# Altium schematic sheet csi.SchDoc
size A3; DocumentNumber: 1; SheetNumber: 1; SheetTotal: 6; PageSetup: Record=PageOptions|CenterHorizontal=True|CenterVertical=True|PrintScale=0.97|XCorrection=1.00|YCorrection=1.00|PrintKind=1|BorderSize=5000000|LeftOffset=0|BottomOffset=0|Orientation=2|PaperLength=2970|PaperWidth=2100|Scale=100|PaperSource=7|PrintQuality=600|MediaType=1|DitherType=10|PaperKind=A4|PrintScaleMode=1
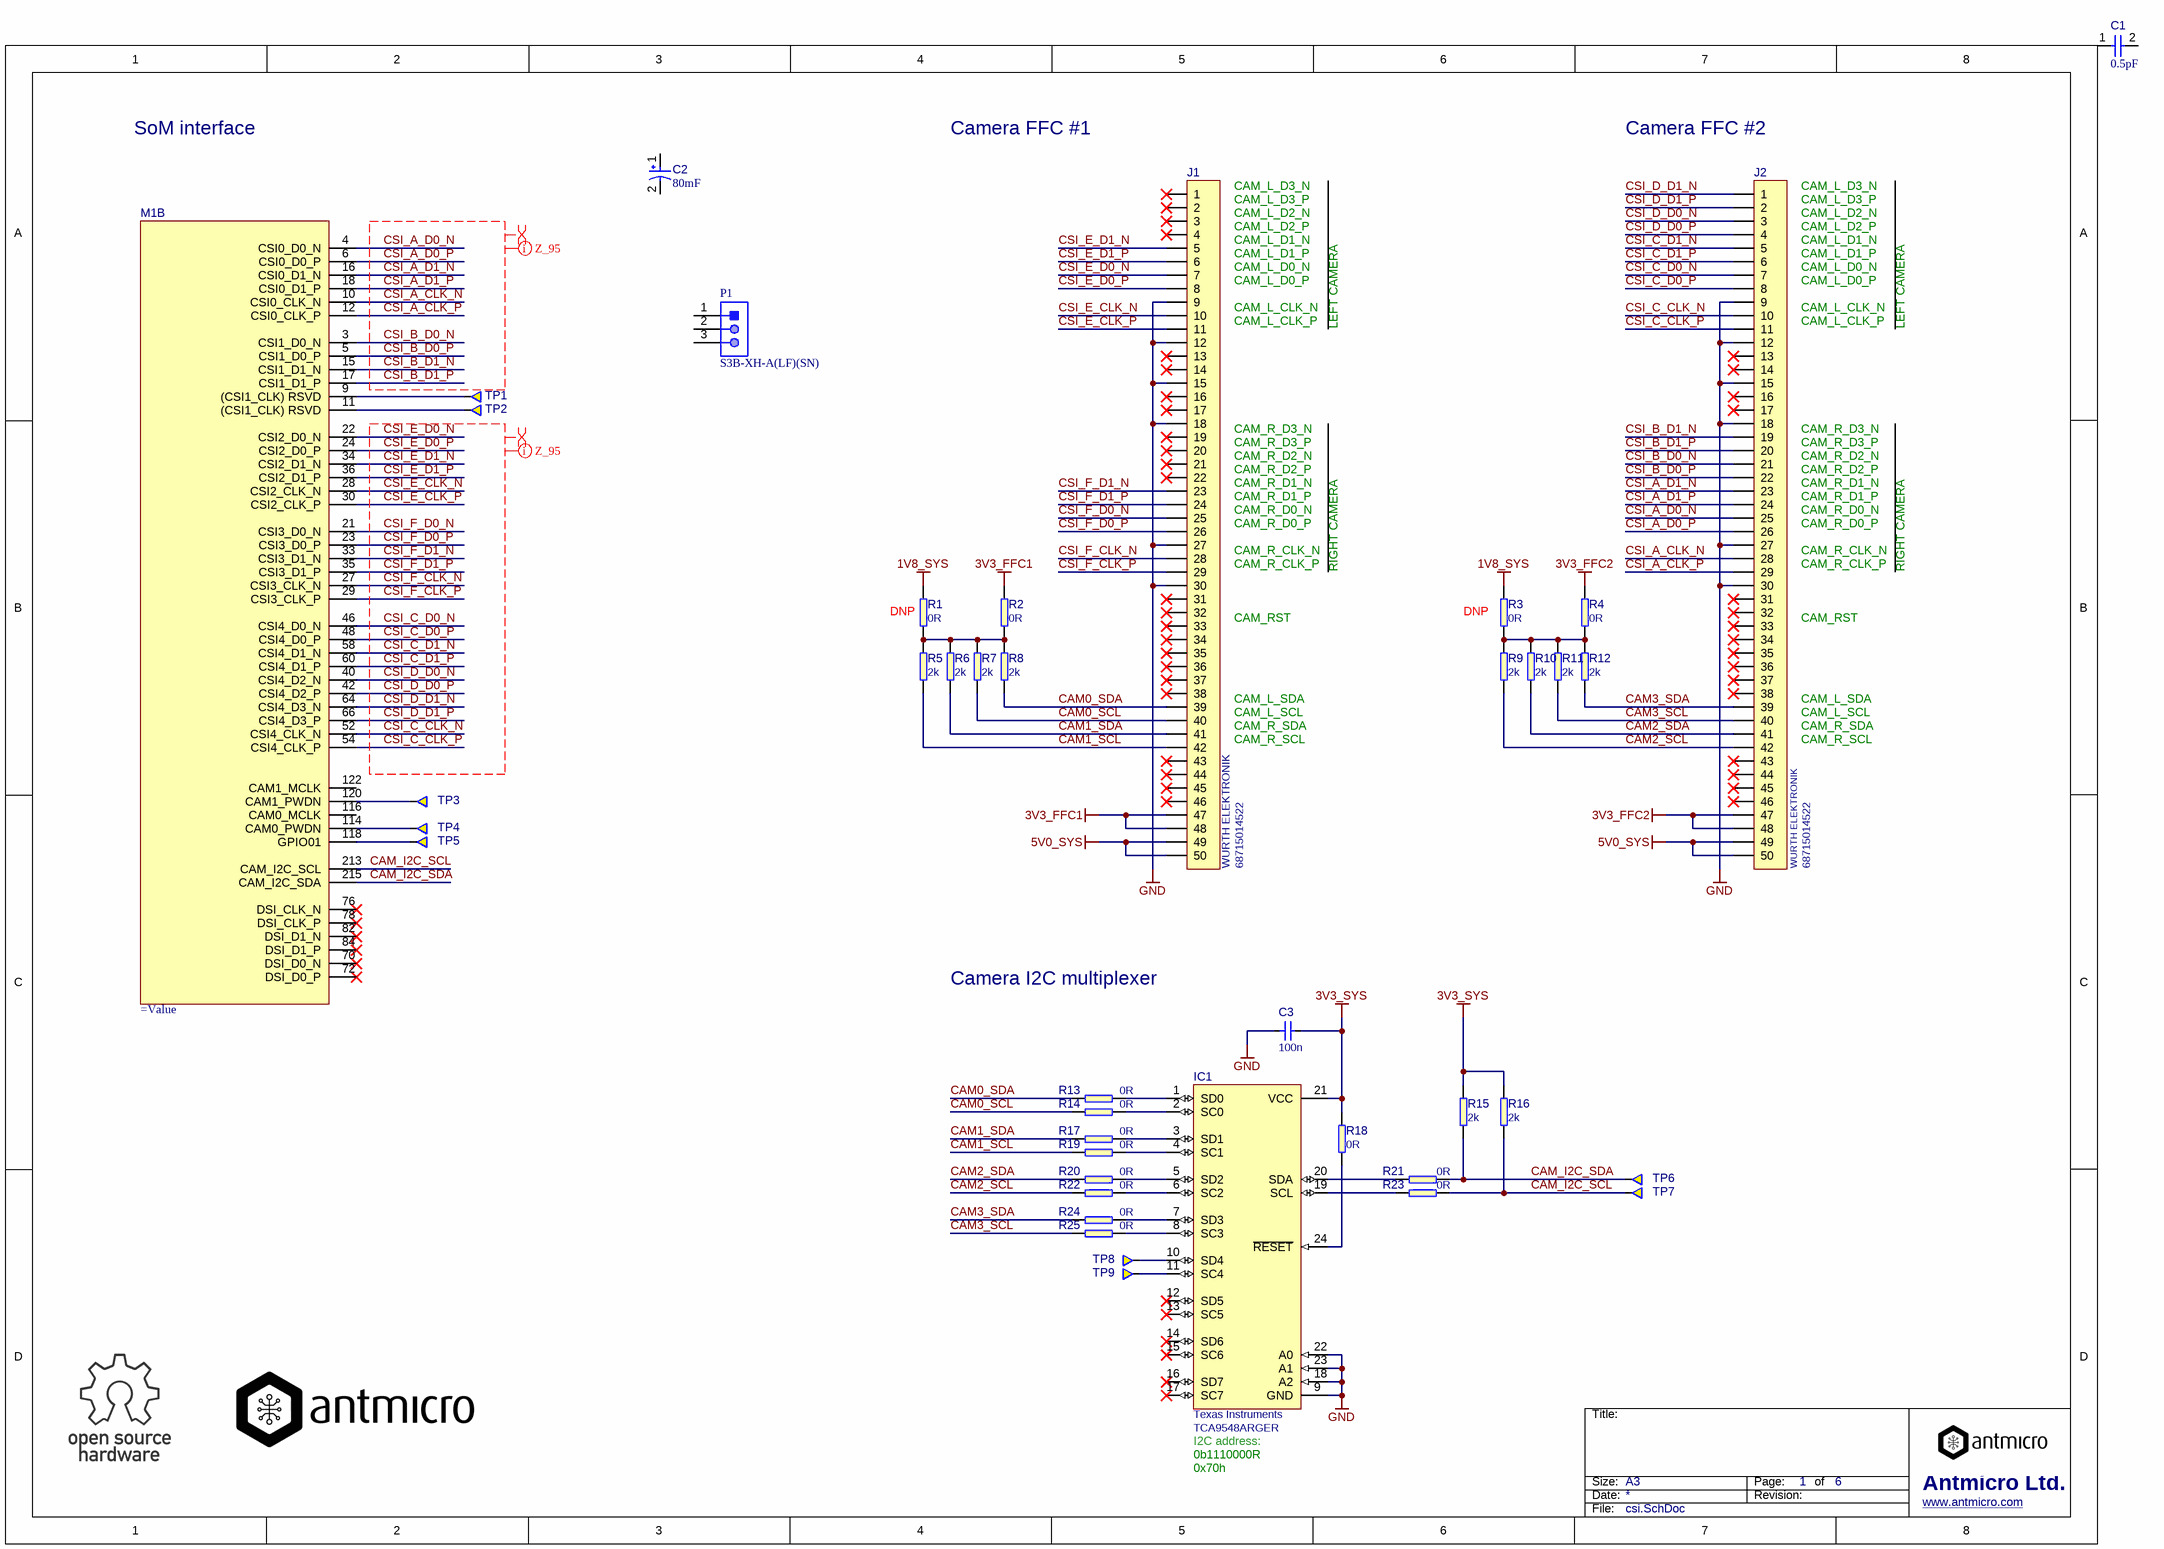
[diagram p0: csi.SchDoc]

## Parts
C1  value 0.5pF  [CAPC1005X56X25ML10T15]  (hidden comment: Capacitor 0.5 pF +/- 0.1pF 25 V 0402)
C2  value 80mF  [SEIK-XH414HG-IV01E_V]  (hidden comment: XH414HG-IV01E)
C3  100n  [0402]
IC1  TCA9548ARGER  Manufacturer: Texas Instruments  [VQFN-24]
J1  68715014522  Manufacturer: WURTH ELEKTRONIK  [68715014522]
J2  68715014522  Manufacturer: WURTH ELEKTRONIK  [68715014522]
M1  (no value)  [jetson-nano-connector]  (part B of 7)
P1  S3B-XH-A(LF)(SN)  [JST-S3B-XH-A(LF)(SN)_V]
R1  0R  [0402]
R2  0R  [0402]
R3  0R  [0402]
R4  0R  [0402]
R5  2k  [0402]
R6  2k  [0402]
R7  2k  [0402]
R8  2k  [0402]
R9  2k  [0402]
R10  2k  [0402]
R11  2k  [0402]
R12  2k  [0402]
R13  0R  [0402]
R14  0R  [0402]
R15  2k  [0402]
R16  2k  [0402]
R17  0R  [0402]
R18  0R  [0402]
R19  0R  [0402]
R20  0R  [0402]
R21  0R  [0402]
R22  0R  [0402]
R23  0R  [0402]
R24  0R  [0402]
R25  0R  [0402]
TP1  Testpad  [TP-R-1.5]  (value not drawn)  (no BOM)
TP2  Testpad  [TP-R-1.5]  (value not drawn)  (no BOM)
TP3  Testpad  [TP-R-1.5]  (value not drawn)  (no BOM)
TP4  Testpad  [TP-R-1.5]  (value not drawn)  (no BOM)
TP5  Testpad  [TP-R-1.5]  (value not drawn)  (no BOM)
TP6  Testpad  [TP-R-1.5]  (value not drawn)  (no BOM)
TP7  Testpad  [TP-R-1.5]  (value not drawn)  (no BOM)
TP8  Testpad  [TP-R-1.5]  (value not drawn)  (no BOM)
TP9  Testpad  [TP-R-1.5]  (value not drawn)  (no BOM)

## Nets
1V8_SYS: R1.2 R3.2
3V3_FFC1: J1.47 J1.48 R2.2
3V3_FFC2: J2.47 J2.48 R4.2
3V3_SYS: C3.2 IC1.21(VCC) R15.1 R16.1 R18.2
5V0_SYS: J1.49 J1.50 J2.49 J2.50
GND: C3.1 IC1.9(GND) IC1.18(A2) IC1.22(A0) IC1.23(A1) J1.9 J1.12 J1.15 J1.18 J1.27 J1.30 J2.9 J2.12 J2.15 J2.18 J2.27 J2.30
CAM0_SCL: J1.40 R7.2 R14.1
CAM0_SDA: J1.39 R8.2 R13.1
CAM1_SCL: J1.42 R5.2 R19.1
CAM1_SDA: J1.41 R6.2 R17.1
CAM2_SCL: J2.42 R9.2 R22.1
CAM2_SDA: J2.41 R10.2 R20.1
CAM3_SCL: J2.40 R11.2 R25.1
CAM3_SDA: J2.39 R12.2 R24.1
CAM_I2C_SCL: M1.213(CAM_I2C_SCL) R16.2 R23.2 TP7.1
CAM_I2C_SDA: M1.215(CAM_I2C_SDA) R15.2 R21.2 TP6.1
CSI_A_CLK_N: J2.28 M1.10(CSI0_CLK_N)
CSI_A_CLK_P: J2.29 M1.12(CSI0_CLK_P)
CSI_A_D0_N: J2.25 M1.4(CSI0_D0_N)
CSI_A_D0_P: J2.26 M1.6(CSI0_D0_P)
CSI_A_D1_N: J2.23 M1.16(CSI0_D1_N)
CSI_A_D1_P: J2.24 M1.18(CSI0_D1_P)
CSI_B_D0_N: J2.21 M1.3(CSI1_D0_N)
CSI_B_D0_P: J2.22 M1.5(CSI1_D0_P)
CSI_B_D1_N: J2.19 M1.15(CSI1_D1_N)
CSI_B_D1_P: J2.20 M1.17(CSI1_D1_P)
CSI_C_CLK_N: J2.10 M1.52(CSI4_CLK_N)
CSI_C_CLK_P: J2.11 M1.54(CSI4_CLK_P)
CSI_C_D0_N: J2.7 M1.46(CSI4_D0_N)
CSI_C_D0_P: J2.8 M1.48(CSI4_D0_P)
CSI_C_D1_N: J2.5 M1.58(CSI4_D1_N)
CSI_C_D1_P: J2.6 M1.60(CSI4_D1_P)
CSI_D_D0_N: J2.3 M1.40(CSI4_D2_N)
CSI_D_D0_P: J2.4 M1.42(CSI4_D2_P)
CSI_D_D1_N: J2.1 M1.64(CSI4_D3_N)
CSI_D_D1_P: J2.2 M1.66(CSI4_D3_P)
CSI_E_CLK_N: J1.10 M1.28(CSI2_CLK_N)
CSI_E_CLK_P: J1.11 M1.30(CSI2_CLK_P)
CSI_E_D0_N: J1.7 M1.22(CSI2_D0_N)
CSI_E_D0_P: J1.8 M1.24(CSI2_D0_P)
CSI_E_D1_N: J1.5 M1.34(CSI2_D1_N)
CSI_E_D1_P: J1.6 M1.36(CSI2_D1_P)
CSI_F_CLK_N: J1.28 M1.27(CSI3_CLK_N)
CSI_F_CLK_P: J1.29 M1.29(CSI3_CLK_P)
CSI_F_D0_N: J1.25 M1.21(CSI3_D0_N)
CSI_F_D0_P: J1.26 M1.23(CSI3_D0_P)
CSI_F_D1_N: J1.23 M1.33(CSI3_D1_N)
CSI_F_D1_P: J1.24 M1.35(CSI3_D1_P)
NetIC1_1: IC1.1(SD0) R13.2
NetIC1_2: IC1.2(SC0) R14.2
NetIC1_3: IC1.3(SD1) R17.2
NetIC1_4: IC1.4(SC1) R19.2
NetIC1_5: IC1.5(SD2) R20.2
NetIC1_6: IC1.6(SC2) R22.2
NetIC1_7: IC1.7(SD3) R24.2
NetIC1_8: IC1.8(SC3) R25.2
NetIC1_10: IC1.10(SD4) TP8.1
NetIC1_11: IC1.11(SC4) TP9.1
NetIC1_19: IC1.19(SCL) R23.1
NetIC1_20: IC1.20(SDA) R21.1
NetIC1_24: IC1.24(~{RESET}) R18.1
NetM1_9: M1.9((CSI1_CLK)_RSVD) TP1.1
NetM1_11: M1.11((CSI1_CLK)_RSVD) TP2.1
NetM1_114: M1.114(CAM0_PWDN) TP4.1
NetM1_118: M1.118(GPIO01) TP5.1
NetM1_120: M1.120(CAM1_PWDN) TP3.1
NetR1_1: R1.1 R2.1 R5.1 R6.1 R7.1 R8.1
NetR3_1: R3.1 R4.1 R9.1 R10.1 R11.1 R12.1

Not connected (* = marked no-connect by the designer): C1 1 2; C2 1 2; IC1 12(SD5)* 13(SC5)* 14(SD6)* 15(SC6)* 16(SD7)* 17(SC7)*; J1 1* 2* 3* 4* 13* 14* 16* 17* 19* 20* 21* 22* 31* 32* 33* 34* 35* 36* 37* 38* 43* 44* 45* 46*; J2 13* 14* 16* 17* 31* 32* 33* 34* 35* 36* 37* 38* 43* 44* 45* 46*; M1 70(DSI_D0_N)* 72(DSI_D0_P)* 76(DSI_CLK_N)* 78(DSI_CLK_P)* 82(DSI_D1_N)* 84(DSI_D1_P)* 116(CAM0_MCLK) 122(CAM1_MCLK); P1 1 2 3

## Layout directives
differential pair: CSI_A_CLK_N, CSI_A_CLK_P, CSI_A_D0_N, CSI_A_D0_P, CSI_A_D1_N, CSI_A_D1_P, CSI_B_D0_N, CSI_B_D0_P, CSI_B_D1_N, CSI_B_D1_P, CSI_C_CLK_N, CSI_C_CLK_P, CSI_C_D0_N, CSI_C_D0_P, CSI_C_D1_N, CSI_C_D1_P, CSI_D_D0_N, CSI_D_D0_P, CSI_D_D1_N, CSI_D_D1_P, CSI_E_CLK_N, CSI_E_CLK_P, CSI_E_D0_N, CSI_E_D0_P, CSI_E_D1_N, CSI_E_D1_P, CSI_F_CLK_N, CSI_F_CLK_P, CSI_F_D0_N, CSI_F_D0_P, CSI_F_D1_N, CSI_F_D1_P
net class Z_95: CSI_A_CLK_N, CSI_A_CLK_P, CSI_A_D0_N, CSI_A_D0_P, CSI_A_D1_N, CSI_A_D1_P, CSI_B_D0_N, CSI_B_D0_P, CSI_B_D1_N, CSI_B_D1_P, CSI_C_CLK_N, CSI_C_CLK_P, CSI_C_D0_N, CSI_C_D0_P, CSI_C_D1_N, CSI_C_D1_P, CSI_D_D0_N, CSI_D_D0_P, CSI_D_D1_N, CSI_D_D1_P, CSI_E_CLK_N, CSI_E_CLK_P, CSI_E_D0_N, CSI_E_D0_P, CSI_E_D1_N, CSI_E_D1_P, CSI_F_CLK_N, CSI_F_CLK_P, CSI_F_D0_N, CSI_F_D0_P, CSI_F_D1_N, CSI_F_D1_P

## Notes on the sheet
- SoM interface
- Camera FFC #1
- Camera FFC #2
- (near J1) CAM_L_D3_N
- (near J1) CAM_L_D3_P
- (near J1) CAM_L_D2_N
- (near J2) CAM_L_D3_N
- (near J2) CAM_L_D3_P
- (near J2) CAM_L_D2_N
- (near J1) CAM_L_D2_P
- (near J1) CAM_L_D1_N
- (near J1) CAM_L_D1_P
- (near J1) CAM_L_D0_N
- (near J1) CAM_L_D0_P
- (near J2) CAM_L_D2_P
- (near J2) CAM_L_D1_N
- (near J2) CAM_L_D1_P
- (near J2) CAM_L_D0_N
- (near J2) CAM_L_D0_P
- (near J1) CAM_L_CLK_N
- (near J1) CAM_L_CLK_P
- LEFT CAMERA
- (near J2) CAM_L_CLK_N
- (near J2) CAM_L_CLK_P
- (near J1) CAM_R_D3_N
- (near J1) CAM_R_D3_P
- (near J1) CAM_R_D2_N
- (near J1) CAM_R_D2_P
- (near J1) CAM_R_D1_N
- (near J2) CAM_R_D3_N
- (near J2) CAM_R_D3_P
- (near J2) CAM_R_D2_N
- (near J2) CAM_R_D2_P
- (near J2) CAM_R_D1_N
- (near J1) CAM_R_D1_P
- (near J1) CAM_R_D0_N
- (near J1) CAM_R_D0_P
- (near J1) CAM_R_CLK_N
- (near J2) CAM_R_D1_P
- (near J2) CAM_R_D0_N
- (near J2) CAM_R_D0_P
- (near J2) CAM_R_CLK_N
- (near R1) DNP
- (near J1) CAM_RST
- (near J1) CAM_R_CLK_P
- RIGHT CAMERA
- (near R3) DNP
- (near J2) CAM_RST
- (near J2) CAM_R_CLK_P
- (near J1) CAM_L_SDA
- (near J1) CAM_L_SCL
- (near J1) CAM_R_SDA
- (near J1) CAM_R_SCL
- (near J2) CAM_L_SDA
- (near J2) CAM_L_SCL
- (near J2) CAM_R_SDA
- (near J2) CAM_R_SCL
- Camera I2C multiplexer
- 0x70h
- 0b1110000R
- (near IC1) I2C address:
- Title:
- Size:
- Date:
- A3
- Revision:
- Page:
- of
- Antmicro Ltd.
- File:
- www.antmicro.com

## Library data of the parts
C1 = CMP-001-00002-4: Chip Capacitor, 0.5 pF, +/- 0.1pF, 25 V, 0402 (1005 Metric); Capacitor Type: Ceramic; Tolerance: 20%; Voltage Rating: 25V; Case/Package: 0402; Max Operating Temperature: 125°C; RoHS Compliant: True; Min Operating Temperature: -55°C; Mounting Technology: SM; Pins: 2
C2 = CMP-001-00052-5: Electric Double Layer Capacitor, 80 mF, 3.3 V, -20 to 60 degC, RoHS; Manufacturer: Seiko Instruments; Voltage Rating: 3.3V; Capacitor Type: Electrolytic; Max Operating Temperature: 60°C; Package Reference: XH414HG-IV01E; RoHS Compliant: True; Datasheet Version: 39814; Mounting Technology: SM; Datasheet URL: http://media.digikey.com/pdf/Data%20Sheets/Seiko%20Instruments%20PDFs/XH414HG,%20XH409HG.pdf; Pins: 2; Manufacturer URL: http://www.sii.co.jp/en/; Package Description: 2-Pin Surface Mount Device, Diameter 4.8 mm; Case/Package: XH414HG-IV01E; Min Operating Temperature: -20°C
C3 = C_100n_0402: MLCC SMT Capacitor 100n 0402; Manufacturer: TDK; PartSymbol: C1005X5R0J104K050BA; Value: 100n; PartNumber: C_100n_0402
IC1 = TCA9548A: TCA9548ARGER  I2C SWITCH W/ RESET, 8-CH, VQFN-24; Value: TCA9548ARGER; PartNumber: TCA9548ARGER; PartSymbol: TCA9548ARGER
J1 J2 = 1X50: 0.50mm SMT ZIF Horizontal Bottom Contact WR-FPC; PartNumber: WE-687-150-145-22; Pinsnumber: 50; Value: 68715014522; PartSymbol: 68715014522
M1 = Jetson-Nano-new-release: PartNumber: jetson-nano-new-release
P1 = CMP-002-00033-1: Male Header, Pitch 2.5 mm, 1 x 3 Position, Height 6.1 mm, Tail Length 3.4 mm, -25 to 85 degC, RoHS, Bulk; Manufacturer: JST; Case/Package: S3B-XH-A(LF)(SN); Package Reference: S3B-XH-A(LF)(SN); Package Description: Male Header, Pitch 2.5 mm, 1 x 3 Position, Height 6.1 mm, Tail Length 3.4 mm; Connector Type: Header; Manufacturer URL: http://www.jst.com/home2.html; Datasheet Version: May-16; Max Operating Temperature: 85°C; Mounting Technology: TH; Gender: Male; Min Operating Temperature: -25°C; Datasheet URL: http://www.jst-mfg.com/product/pdf/eng/eXH.pdf; RoHS Compliant: Unknown
R1-R4 R13 R14 R17-R25 = R_0R_0402: RES, 0R, 0402; Manufacturer: Panasonic; PartSymbol: ERJ2GE0R00X; Value: 0R; PartNumber: R_0R_0402
R5-R12 R15 R16 = R_2k_0402: RES, 2k, 0402; Manufacturer: VISHAY; PartSymbol: CRCW04022K00FKED; PartNumber: R_2k_0402; Value: 2k
TP1-TP9 = Testpad: Testpad, round, 1.5mm; PartNumber: TP-R-1.5